# Altium schematic sheet DAP-Link.SchDoc
size A4; SheetNumber: 1; SheetTotal: 1
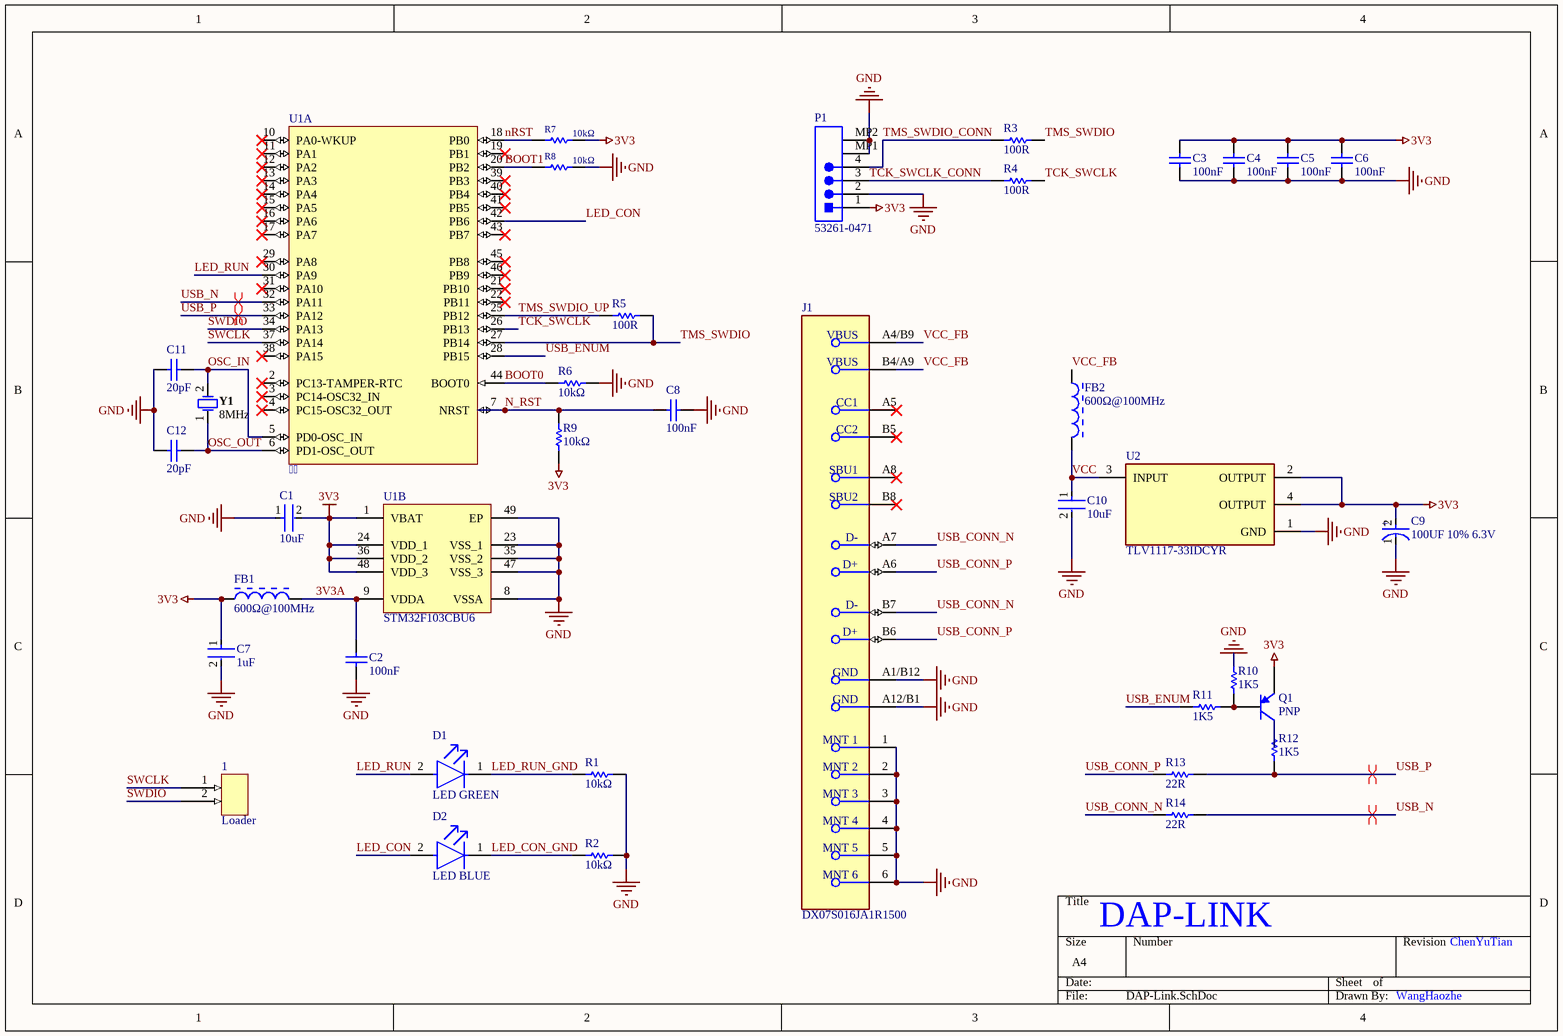
[diagram p0: DAP-Link.SchDoc]

## Parts
1  Loader  [Loader]
C1  10uF  [FP-CL10-IPC_C]
C2  100nF  [CAPC1050X55X23ML05T13]
C3  100nF  [CAPC1050X55X23ML05T13]
C4  100nF  [CAPC1050X55X23ML05T13]
C5  100nF  [CAPC1050X55X23ML05T13]
C6  100nF  [CAPC1050X55X23ML05T13]
C7  1uF  [FP-CL542-IPC_C]
C8  100nF  [CAPC1050X55X23ML05T13]
C9  100UF 10% 6.3V  [FP-TAJB-MFG]
C10  10uF  [FP-CL10-IPC_C]
C11  20pF  [CAPC1608X90X30LL10T20]
C12  20pF  [CAPC1608X90X30LL10T20]
D1  LED GREEN  [FP-LTST-C190GKT-MFG]
D2  LED BLUE  [FP-LTST-C191TBKT-MFG]
FB1  600Ω@100MHz  [MURA-BLM18-F-H1-CHIP-2_V]
FB2  600Ω@100MHz  [MURA-BLM18-F-H1-CHIP-2_V]
J1  DX07S016JA1R1500  [FP-DX07S016JA1R1500-MFG]
P1  53261-0471  [MOLEX-53261-0471_V]
Q1  PNP  [INF-SOT23_N]
R1  10kΩ  [RESC1005X40X25NL05T05]
R2  10kΩ  [RESC1005X40X25NL05T05]
R3  100R  [RESC1608X55X25ML10T15]
R4  100R  [RESC1608X55X25ML10T15]
R5  100R  [RESC1608X55X25ML10T15]
R6  10kΩ  [RESC1005X40X25NL05T05]
R7  10kΩ  [RESC1005X40X25NL05T05]
R8  10kΩ  [RESC1005X40X25NL05T05]
R9  10kΩ  [RESC1005X40X25NL05T05]
R10  1K5  [RESC1005X40X25ML05T10]
R11  1K5  [RESC1005X40X25ML05T10]
R12  1K5  [RESC1005X40X25ML05T10]
R13  22R  [RESC1005X40X25LL05T10]
R14  22R  [RESC1005X40X25LL05T10]
U1    [STM-UFQFPN48_N]  (parts A,B of 2)
U2  TLV1117-33IDCYR  [FP-DCY0004A-MFG]
Y1  8MHz  [NDK-NX3225GD-8MHZ-STD-CRA-3_V]

## Nets
3V3: C1.2 C3.2 C4.2 C5.2 C6.2 C7.1 C9.2(A) FB1.1 P1.1 Q1.2(E) R7.2 R9.2 U1.1(VBAT) U1.24(VDD_1) U1.36(VDD_2) U1.48(VDD_3) U2.2(OUTPUT) U2.4(OUTPUT)
GND: C1.1 C2.1 C3.1 C4.1 C5.1 C6.1 C7.2 C8.2 C9.1(C) C10.2 C11.1 C12.1 J1.1(MNT_1) J1.2(MNT_2) J1.3(MNT_3) J1.4(MNT_4) J1.5(MNT_5) J1.6(MNT_6) J1.A1/B12(GND) J1.A12/B1(GND) P1.2 P1.MP1 P1.MP2 R1.2 R2.2 R6.2 R8.2 R10.1 U1.8(VSSA) U1.23(VSS_1) U1.35(VSS_2) U1.47(VSS_3) U1.49(EP) U2.1(GND)
3V3A: C2.2 FB1.2 U1.9(VDDA)
BOOT0: R6.1 U1.44(BOOT0)
BOOT1: R8.1 U1.20(PB2)
LED_CON: D2.2(A) U1.42(PB6)
LED_CON_GND: D2.1(C) R2.1
LED_RUN: D1.2(A) U1.30(PA9)
LED_RUN_GND: D1.1(C) R1.1
N_RST: C8.1 R9.1 U1.7(NRST)
nRST: R7.1 U1.18(PB0)
OSC_IN: C11.2 U1.5(PD0-OSC_IN) Y1.2
OSC_OUT: C12.2 U1.6(PD1-OSC_OUT) Y1.1
SWCLK: 1.1 U1.37(PA14)
SWDIO: 1.2 U1.34(PA13)
TCK_SWCLK: R4.2 U1.26(PB13)
TCK_SWCLK_CONN: P1.3 R4.1
TMS_SWDIO: R3.2 R5.2 U1.27(PB14)
TMS_SWDIO_CONN: P1.4 R3.1
TMS_SWDIO_UP: R5.1 U1.25(PB12)
USB_CONN_N: J1.A7(D-) J1.B7(D-) R14.1
USB_CONN_P: J1.A6(D+) J1.B6(D+) R13.1
USB_ENUM: R11.2 U1.28(PB15)
USB_N: R14.2 U1.32(PA11)
USB_P: R12.1 R13.2 U1.33(PA12)
VCC: C10.1 FB2.2 U2.3(INPUT)
VCC_FB: FB2.1 J1.A4/B9(VBUS) J1.B4/A9(VBUS)
NetQ1_1: Q1.1(B) R10.2 R11.1
NetQ1_3: Q1.3(C) R12.2

Not connected (* = marked no-connect by the designer): J1 A5(CC1)* A8(SBU1)* B5(CC2)* B8(SBU2)*; U1 2(PC13-TAMPER-RTC)* 3(PC14-OSC32_IN)* 4(PC15-OSC32_OUT)* 10(PA0-WKUP)* 11(PA1)* 12(PA2)* 13(PA3)* 14(PA4)* 15(PA5)* 16(PA6)* 17(PA7)* 19(PB1)* 21(PB10)* 22(PB11)* 29(PA8)* 31(PA10)* 38(PA15)* 39(PB3)* 40(PB4)* 41(PB5)* 43(PB7)* 45(PB8)* 46(PB9)*

## Layout directives
differential pair: USB_N, USB_P

## Notes on the sheet
- DAP-LINK
- ChenYuTian
- WangHaozhe
- (in symbol CMP-04424-000366-1) +

## Library data of the parts
C1 C10 = CMP-13271-004224-1: Cap Ceramic 10uF 25V X5R ±20% Pad SMD 0603 +85°C T/R; Contact Plating: Tin; Case Code (Imperial): 0603; Voltage Rating: 25V; Case/Package: 0603; Packaging: Tape and Reel; Mount: Surface Mount; Termination: Wraparound; Thickness: 0.035inch; Length: 0.063inch; Lead Free: Lead Free; Min Operating Temperature: -55°C; Case Code (Metric): 1608; Capacitance: 10uF; Width: 0.031inch; Max Operating Temperature: 85°C; Dielectric: X5R; Tolerance: 20%; Package Quantity: 1
C2-C6 C8 = CMP-2000-05439-1: Chip Capacitor, 100 nF, +/- 10%, 16 V, -55 to 125 degC, 0402 (1005 Metric), RoHS, Tape and Reel; Manufacturer: Samsung Electro-Mechanics; Capacitance: 100000pF; Dielectric: X7R; Rated Voltage: 16V; Case Size/Dimension: 0402; Tolerance (%): ±10%; Manufacturer URL: http://www.samsungsem.com/global/index.jsp; Datasheet URL: https://datasheet.ciiva.com/29198/458718-da-01-en-vs-kondensator-0402-29198423.pdf; Datasheet Version: Nov-10
C7 = CMP-13271-001051-1: Cap Ceramic 1uF 25V X5R ±10% SMD 0402 +85°C Paper T/R; Capacitance: 1uF; Lead Free: Lead Free; Material: Ceramic; Tolerance: 10%; Thickness: 0.022inch; Height: 0.5mm; Max Operating Temperature: 85°C; Min Operating Temperature: -55°C; Case/Package: 0402; Packaging: Tape and Reel; Radiation Hardening: No; Case Code (Imperial): 0402; Length: 1mm; Case Code (Metric): 1005; Voltage Rating: 25V; Package Quantity: 10000; Dielectric: X5R; Depth: 0.5mm; Width: 0.02inch; Mount: Surface Mount
C9 = CMP-04424-000366-1: 100uF 6.3V  ±10% 1.7Ω 1210  SMD Tantalum Capacitor; Leakage Current: 6.3uA; Polarity: Polar; ESR (Equivalent Series Resistance): 1.7R; Features: General Purpose; Tolerance: 10%; Construction: Flat; Height: 1.9mm; Package Quantity: 1; Voltage: 6.3V; Width: 2.8mm; Case/Package: 1210; Case Code (Metric): 3528; Voltage Rating: 6.3V; Lead Free: Lead Free; Mount: Surface Mount; Max Operating Temperature: 125°C; Dielectric Material: Tantalum; Capacitance: 100uF; Packaging: Tape and Reel; Depth: 2.8mm; Dissipation Factor: 10%; RoHS Compliant: Yes; Case Code (Imperial): 1210; Series: TAJ; Termination: SMD/SMT; Voltage Rating (DC): 6.3V; Height - Seated (Max): 0.083inch; Length: 3.5mm; Min Operating Temperature: -55°C; REACH SVHC: No SVHC; Radiation Hardening: No
C11 C12 = CMP-2000-06100-1: Chip Capacitor, 20 pF, +/- 5%, 50 V, -55 to 85 degC, 0603 (1608 Metric), RoHS, Tape and Reel; Manufacturer: Samsung Electro-Mechanics; Dielectric: C0G; Rated Voltage: 50V; Tolerance (%): ±5%; Case Size/Dimension: 0603; Datasheet Version: 06/2016; Manufacturer URL: http://www.samsungsem.com/global/index.jsp; Capacitance: 20pF; Datasheet URL: http://www.samsungsem.com/kr/support/product-search/mlcc/__icsFiles/afieldfile/2016/08/18/S_CL10C200JB8NNNC.pdf; Mounting Technology: SurfaceMount; Package Description: 2-Pin Surface Mount Device, Body 1.60 x 0.80 mm; Package Reference: 0603
D1 = CMP-22017-000005-1: LED GREEN CLEAR CHIP SMD; Reverse Voltage: 5V; Power Dissipation: 100mW; Forward Voltage: 2.1V; Test Current: 10mA; Number of LEDs: 1; Viewing Angle: 130°; Forward Current: 30mA; Voltage: 2V; Wavelength: 565nm; Dominant Wavelength: 569nm; Luminous Intensity: 6mcd; Lens Color: Colorless; Packaging: Tape and Reel; Lens Transparency: Clear; Min Operating Temperature: -55°C; Case Code (Metric): 1608; Lens Style: Clear; Case/Package: 0603; Mount: Surface Mount; Package Quantity: 1; Height: 0.8mm; Illumination Color: Green; Radiation Hardening: No; Depth: 0.8mm; Number of Pins: 2; Max Operating Temperature: 85°C; Color: Green; Number of Elements: 1; Power Rating: 100mW; Case Code (Imperial): 0603; Width: 0.8mm; Length: 1.6mm; Lead Free: Lead Free
D2 = CMP-22017-000008-1: LED BLUE CLEAR CHIP SMD; Reverse Voltage: 5V; Dominant Wavelength: 475nm; Luminous Intensity: 180mcd; Number of LEDs: 1; Lens Color: Colorless; Lens Style: Diffused; Wavelength: 468nm; Forward Current: 20mA; Forward Voltage: 3.8V; Max Power Dissipation: 75mW; Viewing Angle: 130°; Power Dissipation: 76mW; Number of Pins: 2; Package Quantity: 1; Illumination Color: Blue; Lens Transparency: Clear; Max Operating Temperature: 80°C; Height: 0.55mm; Case Code (Imperial): 0603; Min Operating Temperature: -20°C; Width: 0.8mm; Test Current: 20mA; Depth: 1.6mm; Number of Elements: 1; Color: Blue; Lead Free: Lead Free; Packaging: Tape and Reel; Case Code (Metric): 1608; Radiation Hardening: No; Mount: Surface Mount; Length: 0.8mm; Case/Package: 0603
FB1 FB2 = CMP-0686-00436-2: Chip Ferrite Bead for General Use, 600 Ohm, 500 mA, -55 to 125 degC, 1.6 x 0.8 x 0.95 mm SMD, Tape and Reel; Manufacturer: Murata; PartNumber: BLM18AG601SN1D; DC Resistance: 0.38 Ohm Max.; Impedance (at 100 MHz): 600 Ohm +/- 25%; Rated Current: 500 mA; ComponentLink3Description: Package Specification; ComponentLink1Description: Manufacturer URL; ComponentLink1URL: http://www.murata.com/; DatasheetVersion: 08/2013; ComponentLink2URL: http://www.murata.com/products/catalog/pdf/c31e.pdf; PackageReference: BLM18_H950-2; PackageDescription: 2-Pin Chip, Body 1.6 x 0.8 mm; Mounting Technology: Surface Mount; ComponentLink2Description: Datasheet; Packing: Tape and Reel; ComponentLink3URL: http://www.murata.com/products/catalog/pdf/c31e.pdf; Operating Temperature Range: -55 to 125 degC
J1 = CMP-19038-000003-1: CONN RCP USB2.0 TYP C 24P SMD RA
P1 = CMP-2000-05238-1: Male Header, Pitch 1.25 mm, 1 x 4 Position, Height 3.4 mm, -40 to 85 degC, RoHS, Tape and Reel; Current Rating: 1A; Brand: Molex; Number of Positions / Contacts: 4; Pitch: 1.25mm; Voltage Rating: 125V; Mounting Angle: Right; Manufacturer URL: http://www.molex.com/; Factory Pack Quantity: 1000; Housing Material: Thermoplastic; Datasheet URL: http://www.molex.com/pdm_docs/sd/532610471_sd.pdf; Tradename: PicoBlade; Product Type: Headers; Contact Plating: Tin; Contact Material: PhosphorBronze; Package Description: 1.25mm Pitch PicoBlade(TM) Header, Surface Mount, Right Angle, Lead-Free, 4 Circuits; Mounting Style: SMD/SMT; Manufacturer: Molex; Series: 53261; Packaging: Reel; Number of Rows: 1; RoHS: Details; Number of Positions: 4; Product Category: Headers&WireHousings; Datasheet Version: Rev. G, 01/2012; Type: Shrouded; Termination Style: SMD
Q1 = CMP-1178-00006-1: PNP Silicon Switching Transistor, 40 V VCEO, 200 mA IC, SOT23, Reel, Green; Manufacturer: Infineon; PartNumber: SMBT3906; VCE (max): 1 V; VEBO (max): 6 V; ICBO (max): 50 nA; Green: TRUE; IC: 10 mA; IC (max): 200 mA; VCBO (max): 40 V; Polarity: PNP; ComponentLink3Description: Package Specification; PackageDescription: 3-Pin Small Outline Transistor Package, 1.3 x 2.9 mm Body, 0.95 mm Pitch; ComponentLink2Description: Datasheet; ComponentLink3URL: http://www.infineon.com/dgdl/SOT23-Package_Overview.pdf?folderId=db3a30431936bc4b0119532290053c66&fileId=db3a30431936bc4b0119533468123c85; ComponentLink2URL: http://www.infineon.com/dgdl/smbt3906_mmbt3906series.pdf?folderId=db3a30431441fb5d011445fab851018e&fileId=db3a30431441fb5d01144604610f0192; PackageVersion: Apr-08; ComponentLink1URL: http://www.infineon.com/; Packing: Reel; PackageReference: SOT23; Mounting Technology: Surface Mount; VCE: 1 V; ComponentLink1Description: Manufacturer URL; VCEO (max): 40 V
R1 R2 R6-R9 = CMP-2002-08135-1: Manufacturer: Vishay Dale; Part Number: CRCW040210K0FKED
R3-R5 = CMP-2100-03663-1: Chip Resistor, 100 Ohm, +/- 1%, 0.1 W, -55 to 155 degC, 0603 (1608 Metric), RoHS, Tape and Reel; Manufacturer: Yageo; Voltage Rating (DC): 50V; Power Rating: 100mW; Resistance: 100Ohm; Temperature Coefficient: 100ppm/degreesC; Number of Pins: 2; Tolerance: 1%; Height: 0.45mm; Manufacturer URL: http://www.yageo.com/; Military Standard: Not; Datasheet URL: http://www.yageo.com/NewPortal/yageodocoutput?fileName=/pdf/R-Chip/PYu-RC_Group_51_RoHS_L_5.pdf; Case Code (Imperial): 0603; Termination: SMD/SMT; Lead Free: LeadFree; Max Operating Temperature: 155degC; Case Code (Metric): 1608; RoHSCompliant: true; Voltage Rating: 50V; Width: 0.8mm; Composition: ThickFilm; Depth: 0.8mm; REACH SVHC: Unknown; Min Operating Temperature: -55degC; Packaging: TapeandReel; Package Description: 2-Pin Surface Mount Device, Body 1.6 x 0.8 mm; Length: 1.6mm; Package Reference: 0603; Datasheet Version: Rev. 5, 10/2016; Case/Package: 0603
R10-R12 = CMP-2002-07464-1: Manufacturer: Yageo / Phycomp; Part Number: RC0402FR-071K5L
R13 R14 = CMP-2002-07520-1: Manufacturer: Yageo / Phycomp; Part Number: RC0402FR-0722RL
U1 = CMP-0237-00051-3: ARM Cortex-M3 32-bit MCU, 128 KB Flash, 20 KB Internal RAM, 37 I/Os, 48-pin UFQFPN, -40 to 85 degC, Tray; PartNumber: STM32F103CBU6; I/Os (High Current): 37; Supply Voltage(Vcc) min (V): 2; FLASH Size (Prog) (kB): 128; Operating Frequency(F) (Processor speed) (MHz): 72; A/D Converter: 2x12-bit (10 Channel); Internal RAM Size (kB): 20; DatasheetVersion: Rev. 16; ComponentLink2Description: Datasheet; ComponentLink3Description: Package Specification; ComponentLink1URL: http://www.st.com/web/en/home.html; PackageVersion: Rev. 1, 04/2013; ComponentLink2URL: http://www.st.com/st-web-ui/static/active/en/resource/technical/document/datasheet/CD00161566.pdf; PackageDescription: 48-Pin Ultra Thin Fine Pitch Quad Flat No-Lead, 7 x 7 x 0.6 mm Body, 0.5 mm Pitch, Exposed Pad; Mounting Technology: Surface Mount; Packing: Tray; Core: ARM Cortex-M3; ComponentLink3URL: http://www.st.com/st-web-ui/static/active/en/resource/technical/document/data_brief/DM00071938.pdf; PackageReference: UFQFPN48; ComponentLink1Description: Manufacturer URL
U2 = CMP-04917-000056-1: IC REG LIN 3.3V 800MA SOT223-4; Manufacturer: Texas Instruments; Nominal Supply Current: 5mA; Dropout Voltage: 1.2V; Max Supply Voltage: 15V; Min Supply Voltage: 4.7V; Output Type: Fixed; Number Of Outputs: 1; Output Current: 0.8A; Standoff Height: 0.02mm; Max Junction Temp: +125°C; Lead Free: Yes; RoHS: TRUE; Temperature: -40°C to +125°C; Device Class L1: Integrated Circuits (ICs); Output Voltage: 3.3V; Device Class L3: Voltage Regulators - Linear; Octopart: https://octopart.com/tlv1117-33idcyr-texas+instruments-669250; Device Class L2: Power Management ICs; Package: DCY0004A; Temperature Range High: +125°C; Category: IC; Height: 1.8mm; Automotive: No; Digikey Description: IC REG LIN 3.3V 800MA SOT223-4; Temperature Range Low: -40°C; ComponentLink2URL: http://www.ti.com/lit/ds/symlink/tlv1117.pdf; ComponentLink2Description: Datasheet; Manufacturer Part Number: TLV1117-33IDCYR; Mouser Description: LDO Voltage Regulators Fixed LDO Volt Reg
Y1 = CMP-2000-07595-1: Crystal Unit, 8 MHz, 8 pF, -40 to 150 degC, 2-Pin SMD, RoHS, Tape and Reel; Manufacturer: NDK; Load Capacitance: 8pF; ESR (Equivalent Series Resistance): 500Ohm; Frequency Tolerance: 50ppm; Frequency Stability: 150ppm; Case/Package: SMD/SMT; Datasheet Version: 11/2016; Min Operating Temperature: -40degC; Packaging: TapeandReel; Width: 0.098inch; Package Quantity: 3000; Number of Pins: 2; Package Description: 2-Pin Surface Mount Device, Body 3.2 x 2.5 mm; RoHSCompliant: True; Package Reference: NX3225GD-8MHZ-STD-CRA-3; Datasheet URL: http://www.ndk.com/images/products/catalog/c_NX3225GD-STD-CRA-3_e.pdf; Mounting Technology: SurfaceMount; Length: 0.126inch; Mount: SurfaceMount; Manufacturer URL: http://www.ndk.com/en/; Max Operating Temperature: 150degC; Frequency: 8MHz; Height: 0.039inch